# Altium schematic sheet Beaglebone_black.SchDoc: Humpback
size 420 x 297 mm; Author: G.Kasprowicz; CompanyName: WUT ISE; DrawnBy: G.Kasprowicz; Organization: WUT ISE; Address1: PW ISE; Address2: Nowowiejska 15/19 00-665 Warsaw; Address3: gkasprow@gmail.com; DocumentNumber: 8; Revision: 1.0; SheetNumber: 8; SheetTotal: 11; ModifiedBy: -; CheckedDate: -; Title2: Beaglebone black v1.0; DivGrp: WUT ISE; Designer: G.Kasprowicz; ModifiedDate: -; ProjectName: Sensor Box
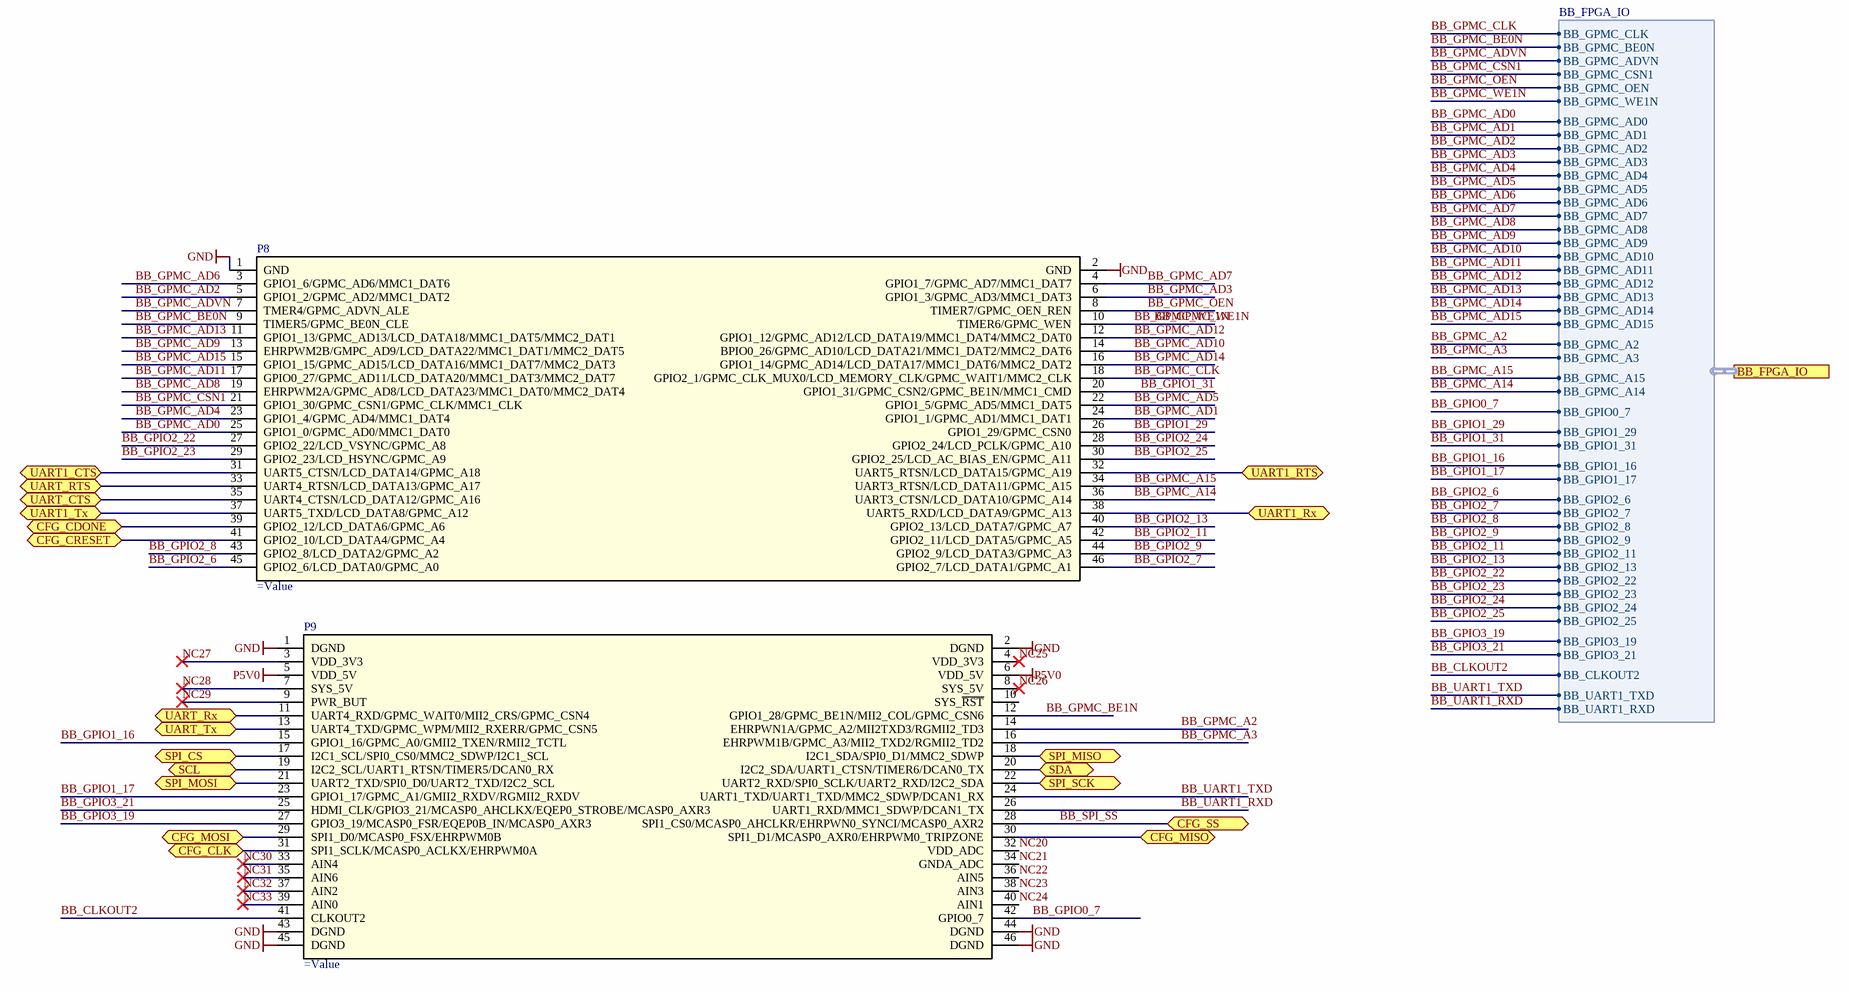
[diagram p0: Beaglebone_black.SchDoc]

## Parts
P8  (no value)  [MOD_BEAGLEBONE_P8]
P9  (no value)  [MOD_BEAGLEBONE_P9]

## Ports
BB_FPGA_IO (harness BB_FPGA_IO), CFG_CDONE (bidir), CFG_CLK (bidir), CFG_CRESET (bidir), CFG_MISO (bidir), CFG_MOSI (bidir), CFG_SS (bidir), SCL (bidir), SDA (bidir), SPI_CS (bidir), SPI_MISO (bidir), SPI_MOSI (bidir), SPI_SCK (bidir), UART1_CTS (bidir), UART1_RTS (bidir), UART1_Rx (bidir), UART1_Tx (bidir), UART_CTS (bidir), UART_RTS (bidir), UART_Rx (bidir), UART_Tx (bidir)

## Harnesses
BB_FPGA_IO: BB_GPMC_CLK, BB_GPMC_BE0N, BB_GPMC_CSN1, BB_GPMC_OEN, BB_GPMC_AD0, BB_GPMC_AD1, BB_GPMC_AD2, BB_GPMC_AD3, BB_GPMC_AD4, BB_GPMC_AD5, BB_GPMC_AD6, BB_GPMC_AD7, BB_GPMC_AD8, BB_GPMC_AD9, BB_GPMC_AD10, BB_GPMC_AD11, BB_GPMC_AD12, BB_GPMC_AD13, BB_GPMC_AD14, BB_GPMC_AD15, BB_GPMC_A2, BB_GPMC_A3, BB_GPMC_A15, BB_GPMC_A14, BB_GPIO0_7, BB_GPIO1_29, BB_GPIO1_31, BB_GPIO1_16, BB_GPIO1_17, BB_GPIO2_6, BB_GPIO2_7, BB_GPIO2_8, BB_GPIO2_9, BB_GPIO2_11, BB_GPIO2_13, BB_GPIO2_22, BB_GPIO2_23, BB_GPIO2_24, BB_GPIO2_25, BB_GPIO3_19, BB_GPIO3_21, BB_CLKOUT2, BB_UART1_TXD, BB_UART1_RXD, BB_GPMC_ADVN, BB_GPMC_WE1N

## Nets
GND: P8.1(GND) P8.2(GND) P9.1(DGND) P9.2(DGND) P9.43(DGND) P9.44(DGND) P9.45(DGND) P9.46(DGND)
P5V0: P9.5(VDD_5V) P9.6(VDD_5V)
BB_CLKOUT2: P9.41(CLKOUT2) ; port BB_FPGA_IO.BB_CLKOUT2
BB_GPIO0_7: P9.42(GPIO0_7) ; port BB_FPGA_IO.BB_GPIO0_7
BB_GPIO1_16: P9.15(GPIO1_16/GPMC_A0/GMII2_TXEN/RMII2_TCTL) ; port BB_FPGA_IO.BB_GPIO1_16
BB_GPIO1_17: P9.23(GPIO1_17/GPMC_A1/GMII2_RXDV/RGMII2_RXDV) ; port BB_FPGA_IO.BB_GPIO1_17
BB_GPIO1_29: P8.26(GPIO1_29/GPMC_CSN0) ; port BB_FPGA_IO.BB_GPIO1_29
BB_GPIO1_31: P8.20(GPIO1_31/GPMC_CSN2/GPMC_BE1N/MMC1_CMD) ; port BB_FPGA_IO.BB_GPIO1_31
BB_GPIO2_6: P8.45(GPIO2_6/LCD_DATA0/GPMC_A0) ; port BB_FPGA_IO.BB_GPIO2_6
BB_GPIO2_7: P8.46(GPIO2_7/LCD_DATA1/GPMC_A1) ; port BB_FPGA_IO.BB_GPIO2_7
BB_GPIO2_8: P8.43(GPIO2_8/LCD_DATA2/GPMC_A2) ; port BB_FPGA_IO.BB_GPIO2_8
BB_GPIO2_9: P8.44(GPIO2_9/LCD_DATA3/GPMC_A3) ; port BB_FPGA_IO.BB_GPIO2_9
BB_GPIO2_11: P8.42(GPIO2_11/LCD_DATA5/GPMC_A5) ; port BB_FPGA_IO.BB_GPIO2_11
BB_GPIO2_13: P8.40(GPIO2_13/LCD_DATA7/GPMC_A7) ; port BB_FPGA_IO.BB_GPIO2_13
BB_GPIO2_22: P8.27(GPIO2_22/LCD_VSYNC/GPMC_A8) ; port BB_FPGA_IO.BB_GPIO2_22
BB_GPIO2_23: P8.29(GPIO2_23/LCD_HSYNC/GPMC_A9) ; port BB_FPGA_IO.BB_GPIO2_23
BB_GPIO2_24: P8.28(GPIO2_24/LCD_PCLK/GPMC_A10) ; port BB_FPGA_IO.BB_GPIO2_24
BB_GPIO2_25: P8.30(GPIO2_25/LCD_AC_BIAS_EN/GPMC_A11) ; port BB_FPGA_IO.BB_GPIO2_25
BB_GPIO3_19: P9.27(GPIO3_19/MCASP0_FSR/EQEP0B_IN/MCASP0_AXR3) ; port BB_FPGA_IO.BB_GPIO3_19
BB_GPIO3_21: P9.25(HDMI_CLK/GPIO3_21/MCASP0_AHCLKX/EQEP0_STROBE/MCASP0_AXR3) ; port BB_FPGA_IO.BB_GPIO3_21
BB_GPMC_A2: P9.14(EHRPWN1A/GPMC_A2/MII2TXD3/RGMII2_TD3) ; port BB_FPGA_IO.BB_GPMC_A2
BB_GPMC_A3: P9.16(EHRPWM1B/GPMC_A3/MII2_TXD2/RGMII2_TD2) ; port BB_FPGA_IO.BB_GPMC_A3
BB_GPMC_A14: P8.36(UART3_CTSN/LCD_DATA10/GPMC_A14) ; port BB_FPGA_IO.BB_GPMC_A14
BB_GPMC_A15: P8.34(UART3_RTSN/LCD_DATA11/GPMC_A15) ; port BB_FPGA_IO.BB_GPMC_A15
BB_GPMC_AD0: P8.25(GPIO1_0/GPMC_AD0/MMC1_DAT0) ; port BB_FPGA_IO.BB_GPMC_AD0
BB_GPMC_AD1: P8.24(GPIO1_1/GPMC_AD1/MMC1_DAT1) ; port BB_FPGA_IO.BB_GPMC_AD1
BB_GPMC_AD2: P8.5(GPIO1_2/GPMC_AD2/MMC1_DAT2) ; port BB_FPGA_IO.BB_GPMC_AD2
BB_GPMC_AD3: P8.6(GPIO1_3/GPMC_AD3/MMC1_DAT3) ; port BB_FPGA_IO.BB_GPMC_AD3
BB_GPMC_AD4: P8.23(GPIO1_4/GPMC_AD4/MMC1_DAT4) ; port BB_FPGA_IO.BB_GPMC_AD4
BB_GPMC_AD5: P8.22(GPIO1_5/GPMC_AD5/MMC1_DAT5) ; port BB_FPGA_IO.BB_GPMC_AD5
BB_GPMC_AD6: P8.3(GPIO1_6/GPMC_AD6/MMC1_DAT6) ; port BB_FPGA_IO.BB_GPMC_AD6
BB_GPMC_AD7: P8.4(GPIO1_7/GPMC_AD7/MMC1_DAT7) ; port BB_FPGA_IO.BB_GPMC_AD7
BB_GPMC_AD8: P8.19(EHRPWM2A/GPMC_AD8/LCD_DATA23/MMC1_DAT0/MMC2_DAT4) ; port BB_FPGA_IO.BB_GPMC_AD8
BB_GPMC_AD9: P8.13(EHRPWM2B/GMPC_AD9/LCD_DATA22/MMC1_DAT1/MMC2_DAT5) ; port BB_FPGA_IO.BB_GPMC_AD9
BB_GPMC_AD10: P8.14(BPIO0_26/GPMC_AD10/LCD_DATA21/MMC1_DAT2/MMC2_DAT6) ; port BB_FPGA_IO.BB_GPMC_AD10
BB_GPMC_AD11: P8.17(GPIO0_27/GPMC_AD11/LCD_DATA20/MMC1_DAT3/MMC2_DAT7) ; port BB_FPGA_IO.BB_GPMC_AD11
BB_GPMC_AD12: P8.12(GPIO1_12/GPMC_AD12/LCD_DATA19/MMC1_DAT4/MMC2_DAT0) ; port BB_FPGA_IO.BB_GPMC_AD12
BB_GPMC_AD13: P8.11(GPIO1_13/GPMC_AD13/LCD_DATA18/MMC1_DAT5/MMC2_DAT1) ; port BB_FPGA_IO.BB_GPMC_AD13
BB_GPMC_AD14: P8.16(GPIO1_14/GPMC_AD14/LCD_DATA17/MMC1_DAT6/MMC2_DAT2) ; port BB_FPGA_IO.BB_GPMC_AD14
BB_GPMC_AD15: P8.15(GPIO1_15/GPMC_AD15/LCD_DATA16/MMC1_DAT7/MMC2_DAT3) ; port BB_FPGA_IO.BB_GPMC_AD15
BB_GPMC_ADVN: P8.7(TMER4/GPMC_ADVN_ALE) ; port BB_FPGA_IO.BB_GPMC_ADVN
BB_GPMC_BE0N: P8.9(TIMER5/GPMC_BE0N_CLE) ; port BB_FPGA_IO.BB_GPMC_BE0N
BB_GPMC_BE1N: P9.12(GPIO1_28/GPMC_BE1N/MII2_COL/GPMC_CSN6)
BB_GPMC_CLK: P8.18(GPIO2_1/GPMC_CLK_MUX0/LCD_MEMORY_CLK/GPMC_WAIT1/MMC2_CLK) ; port BB_FPGA_IO.BB_GPMC_CLK
BB_GPMC_CSN1: P8.21(GPIO1_30/GPMC_CSN1/GPMC_CLK/MMC1_CLK) ; port BB_FPGA_IO.BB_GPMC_CSN1
BB_GPMC_OEN: P8.8(TIMER7/GPMC_OEN_REN) ; port BB_FPGA_IO.BB_GPMC_OEN
BB_GPMC_WE1N: P8.10(TIMER6/GPMC_WEN) ; port BB_FPGA_IO.BB_GPMC_WE1N
BB_SPI_SS: P9.28(SPI1_CS0/MCASP0_AHCLKR/EHRPWN0_SYNCI/MCASP0_AXR2) ; port CFG_SS
BB_UART1_RXD: P9.26(UART1_RXD/MMC1_SDWP/DCAN1_TX) ; port BB_FPGA_IO.BB_UART1_RXD
BB_UART1_TXD: P9.24(UART1_TXD/UART1_TXD/MMC2_SDWP/DCAN1_RX) ; port BB_FPGA_IO.BB_UART1_TXD
CFG_CDONE: P8.39(GPIO2_12/LCD_DATA6/GPMC_A6) ; port CFG_CDONE
CFG_CLK: P9.31(SPI1_SCLK/MCASP0_ACLKX/EHRPWM0A) ; port CFG_CLK
CFG_CRESET: P8.41(GPIO2_10/LCD_DATA4/GPMC_A4) ; port CFG_CRESET
CFG_MISO: P9.30(SPI1_D1/MCASP0_AXR0/EHRPWM0_TRIPZONE) ; port CFG_MISO
CFG_MOSI: P9.29(SPI1_D0/MCASP0_FSX/EHRPWM0B) ; port CFG_MOSI
NC20: P9.32(VDD_ADC)
NC21: P9.34(GNDA_ADC)
NC22: P9.36(AIN5)
NC23: P9.38(AIN3)
NC24: P9.40(AIN1)
NC25: P9.4(VDD_3V3)
NC26: P9.8(SYS_5V)
NC27: P9.3(VDD_3V3)
NC28: P9.7(SYS_5V)
NC29: P9.9(PWR_BUT)
NC30: P9.33(AIN4)
NC31: P9.35(AIN6)
NC32: P9.37(AIN2)
NC33: P9.39(AIN0)
SCL: P9.19(I2C2_SCL/UART1_RTSN/TIMER5/DCAN0_RX) ; port SCL
SDA: P9.20(I2C2_SDA/UART1_CTSN/TIMER6/DCAN0_TX) ; port SDA
SPI_CS: P9.17(I2C1_SCL/SPI0_CS0/MMC2_SDWP/I2C1_SCL) ; port SPI_CS
SPI_MISO: P9.18(I2C1_SDA/SPI0_D1/MMC2_SDWP) ; port SPI_MISO
SPI_MOSI: P9.21(UART2_TXD/SPI0_D0/UART2_TXD/I2C2_SCL) ; port SPI_MOSI
SPI_SCK: P9.22(UART2_RXD/SPI0_SCLK/UART2_RXD/I2C2_SDA) ; port SPI_SCK
UART1_CTS: P8.31(UART5_CTSN/LCD_DATA14/GPMC_A18) ; port UART1_CTS
UART1_RTS: P8.32(UART5_RTSN/LCD_DATA15/GPMC_A19) ; port UART1_RTS
UART1_Rx: P8.38(UART5_RXD/LCD_DATA9/GPMC_A13) ; port UART1_Rx
UART1_Tx: P8.37(UART5_TXD/LCD_DATA8/GPMC_A12) ; port UART1_Tx
UART_CTS: P8.35(UART4_CTSN/LCD_DATA12/GPMC_A16) ; port UART_CTS
UART_RTS: P8.33(UART4_RTSN/LCD_DATA13/GPMC_A17) ; port UART_RTS
UART_Rx: P9.11(UART4_RXD/GPMC_WAIT0/MII2_CRS/GPMC_CSN4) ; port UART_Rx
UART_Tx: P9.13(UART4_TXD/GPMC_WPM/MII2_RXERR/GPMC_CSN5) ; port UART_Tx

Not connected (* = marked no-connect by the designer): P9 10(SYS_~{RST})

## Notes on the sheet
- Project/Equipment
- Document
- Designer
- Drawn by
- Check.by
- Copyright WUT ISE 2018.
  This documentation describes Open Hardware and is licensed under the CERN OHL v.1.1. You may redistribute and modify this documentation under the terms of the CERN OHL v.1.1. (http://ohwr.org/CERNOHL). This documentation is distributed WITHOUT ANY EXPRESS OR IMPLIED WARRANTY, INCLUDING OF MERCHANTABILITY, SATISFACTORY QUALITY AND FITNESS FOR A PARTICULAR PURPOSE. Please see the CERN OHL v.1.1 for applicable conditions.
- Contact
- File
- Last Mod.
- Print Date
- Sheet
- Size
- A3
- of
- Rev

## Library data of the parts
P8 = MOD_Beagle_Bone_Black_P8-SSQ: Beagle_Bone_Black_P8; Manufacturer: Samtec Inc; Connector Type: Receptacle; Number of Positions: 46; Number of Positions Loaded: All; Pitch: 0.100" (2.54mm); Supplier 1: Digi-Key; RoHS: RoHS Compliant; Category: Connectors, Interconnects; Stock 1: 0; Pricing 1: 1=0 (USD); Packaging: Bulk; Contact Type: Male header; Number of Rows: 2; Row Spacing: 0.100" (2.54mm); Termination: Solder; Fastening Type: -; Features: -; Contact Finish: Gold; Contact Finish Thickness: 20µin (0.51µm); Color: Black; ComponentLink1URL: http://www.samtec.com/documents/webfiles/cpdf/SSQ-1XX-XX-XXX-X-XX-XXX-XX-X-MKT.pdf; ComponentLink1Description: http://www.samtec.com/documents/webfiles/cpdf/SSQ-1XX-XX-XXX-X-XX-XXX-XX-X-MKT.pdf
P9 = MOD_Beagle_Bone_Black_P9-SSQ: Beagle_Bone_Black_P9; Manufacturer: Samtec Inc; Connector Type: Receptacle; Number of Positions: 46; Number of Positions Loaded: All; Pitch: 0.100" (2.54mm); Supplier 1: Digi-Key; RoHS: RoHS Compliant; Category: Connectors, Interconnects; Stock 1: 0; Pricing 1: 1=0 (USD); Packaging: Bulk; Contact Type: Male header; Number of Rows: 2; Row Spacing: 0.100" (2.54mm); Termination: Solder; Fastening Type: -; Features: -; Contact Finish: Gold; Contact Finish Thickness: 20µin (0.51µm); Color: Black; ComponentLink1URL: http://www.samtec.com/documents/webfiles/cpdf/SSQ-1XX-XX-XXX-X-XX-XXX-XX-X-MKT.pdf; ComponentLink1Description: http://www.samtec.com/documents/webfiles/cpdf/SSQ-1XX-XX-XXX-X-XX-XXX-XX-X-MKT.pdf; Supplier Part Number 1: SAM1197-23-ND